# Altium schematic sheet 04-DUT0-1.SchDoc
size 594 x 420 mm
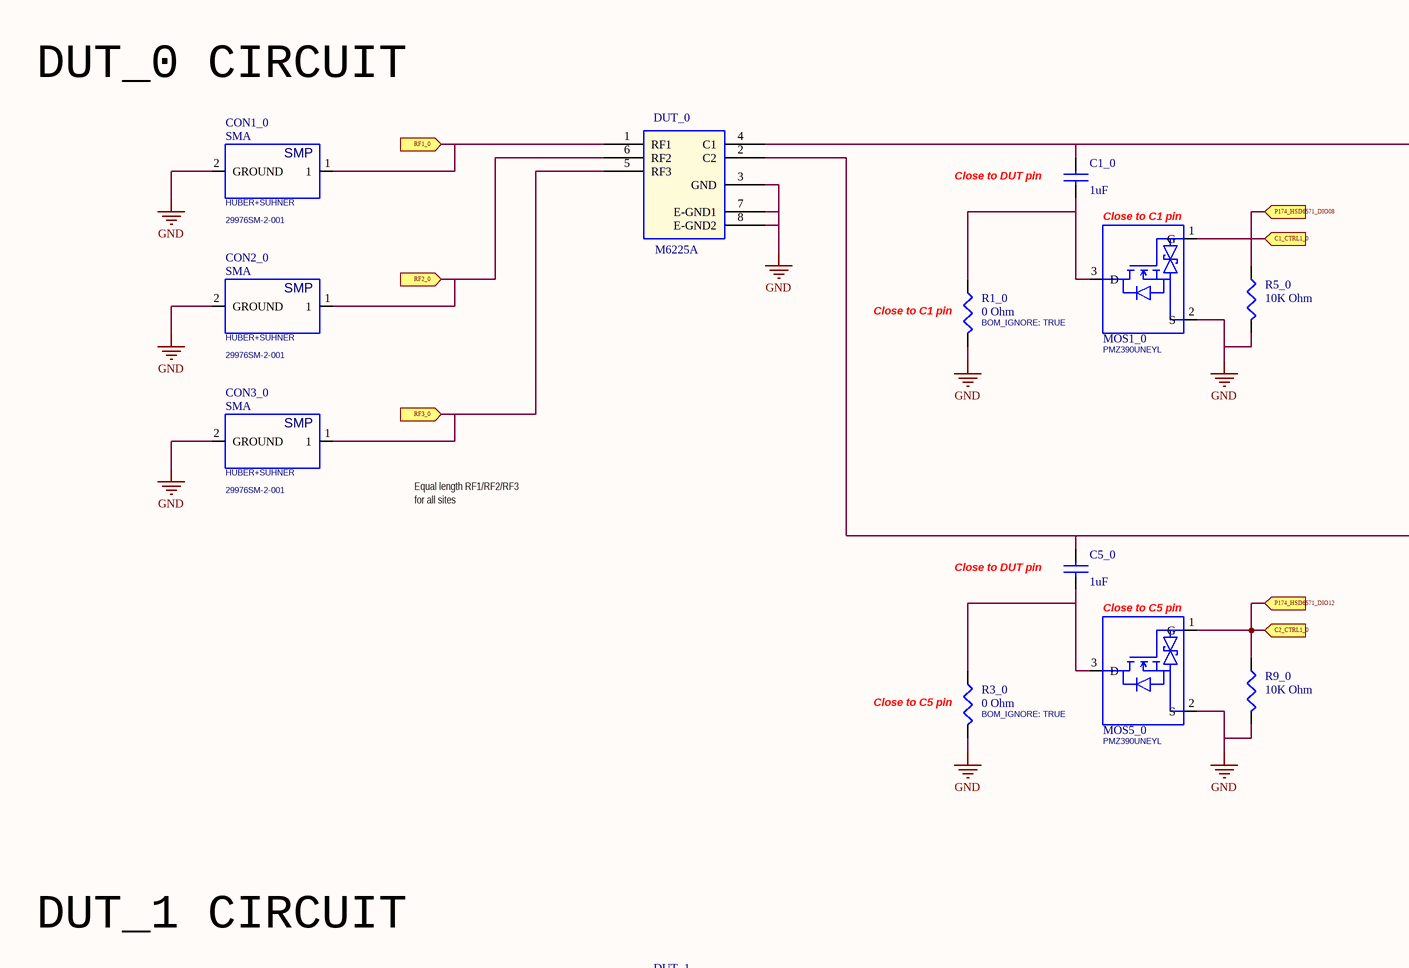
[diagram p0: 04-DUT0-1.SchDoc, top left]
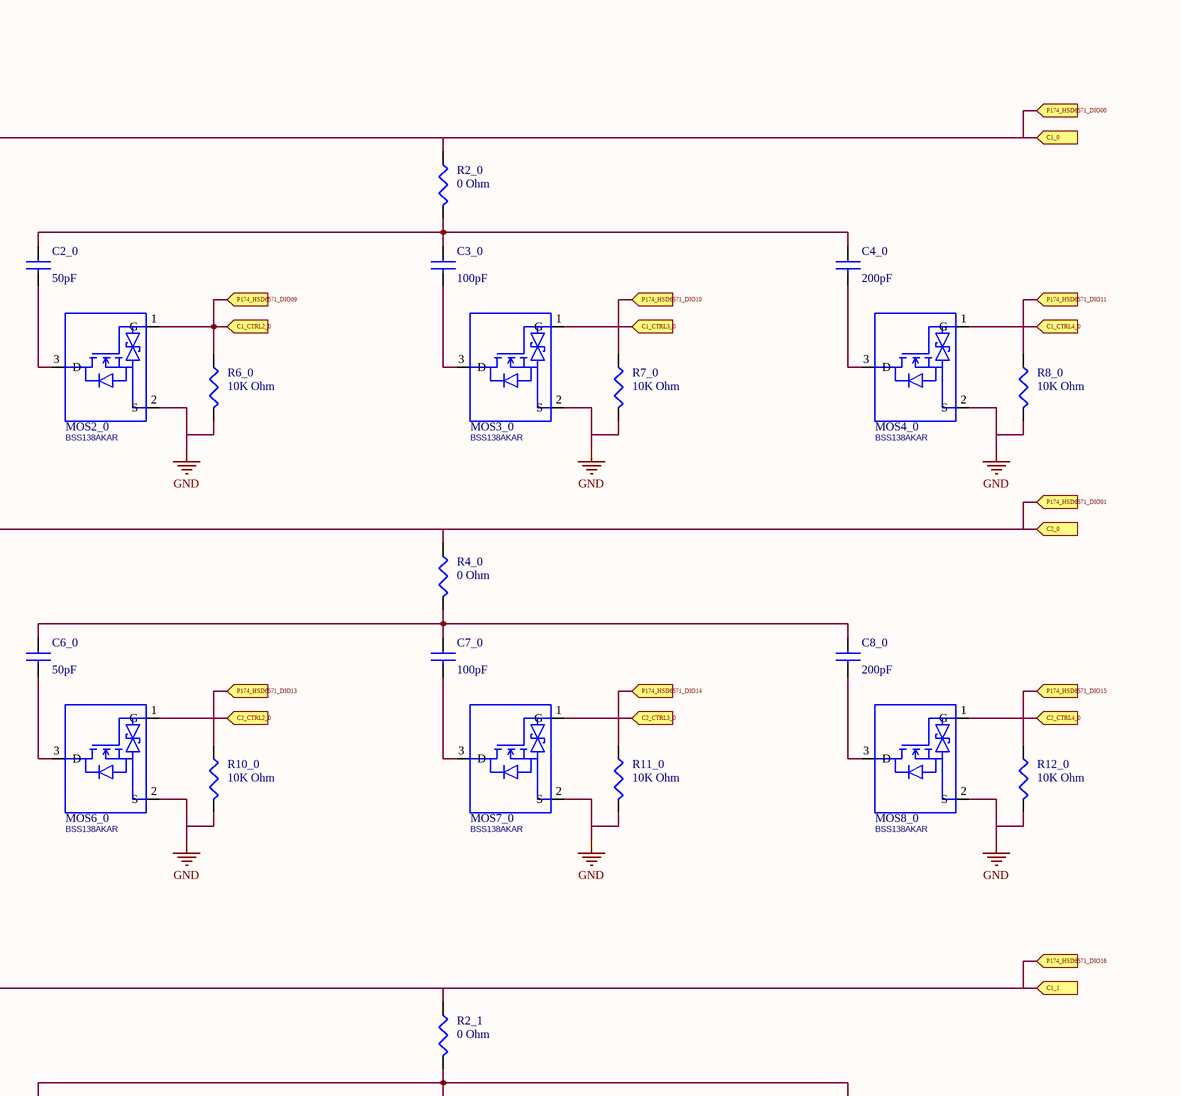
[diagram p1: 04-DUT0-1.SchDoc, top right]
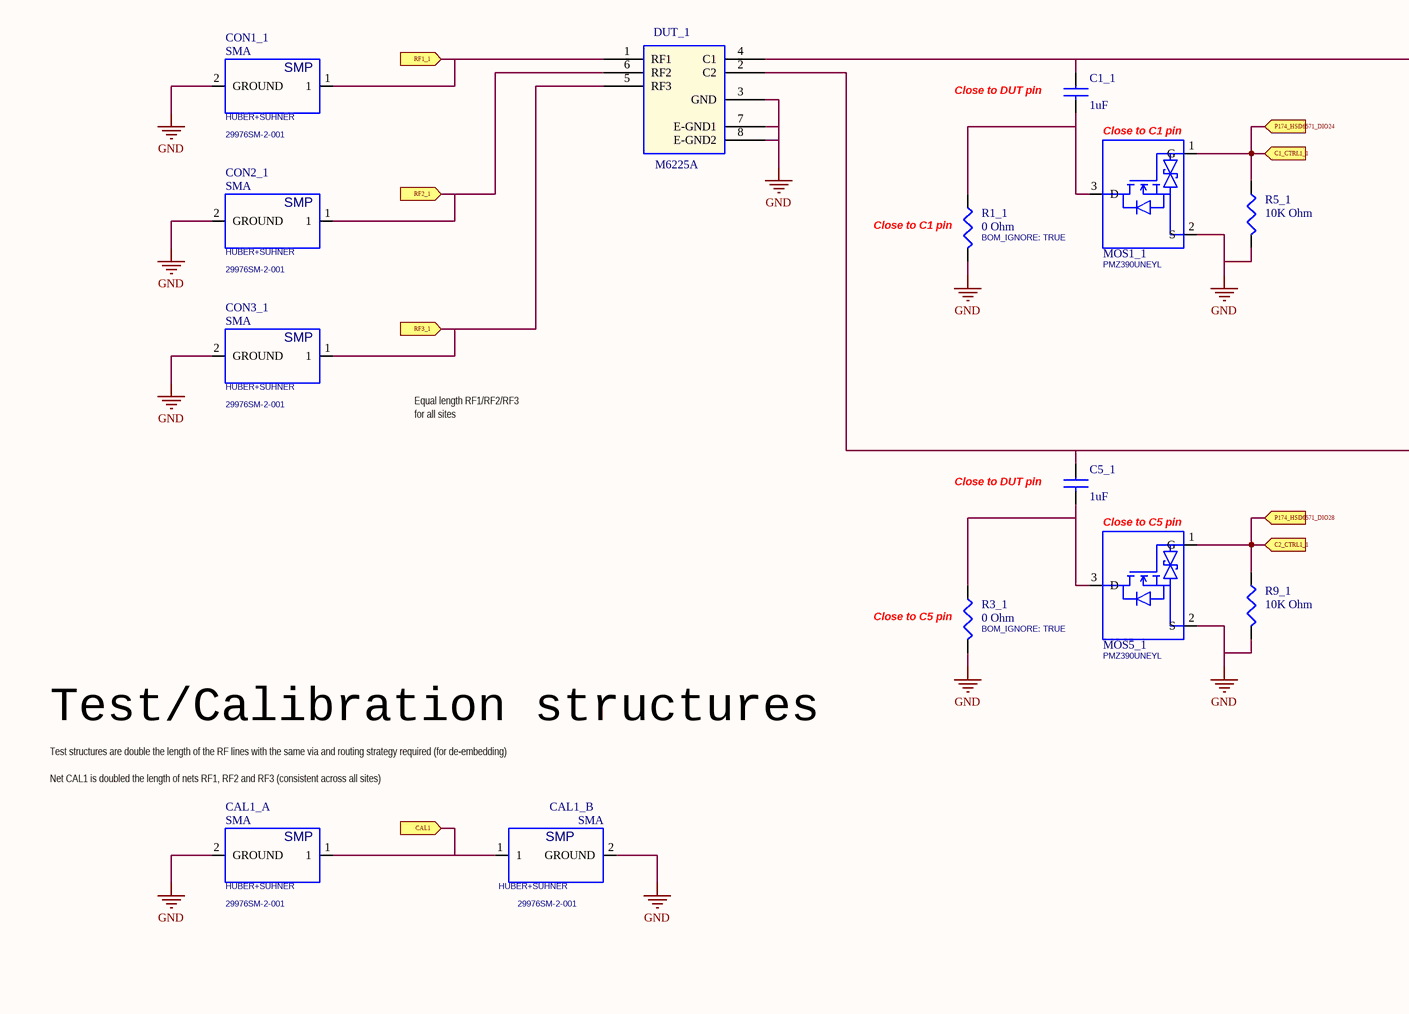
[diagram p2: 04-DUT0-1.SchDoc, bottom left]
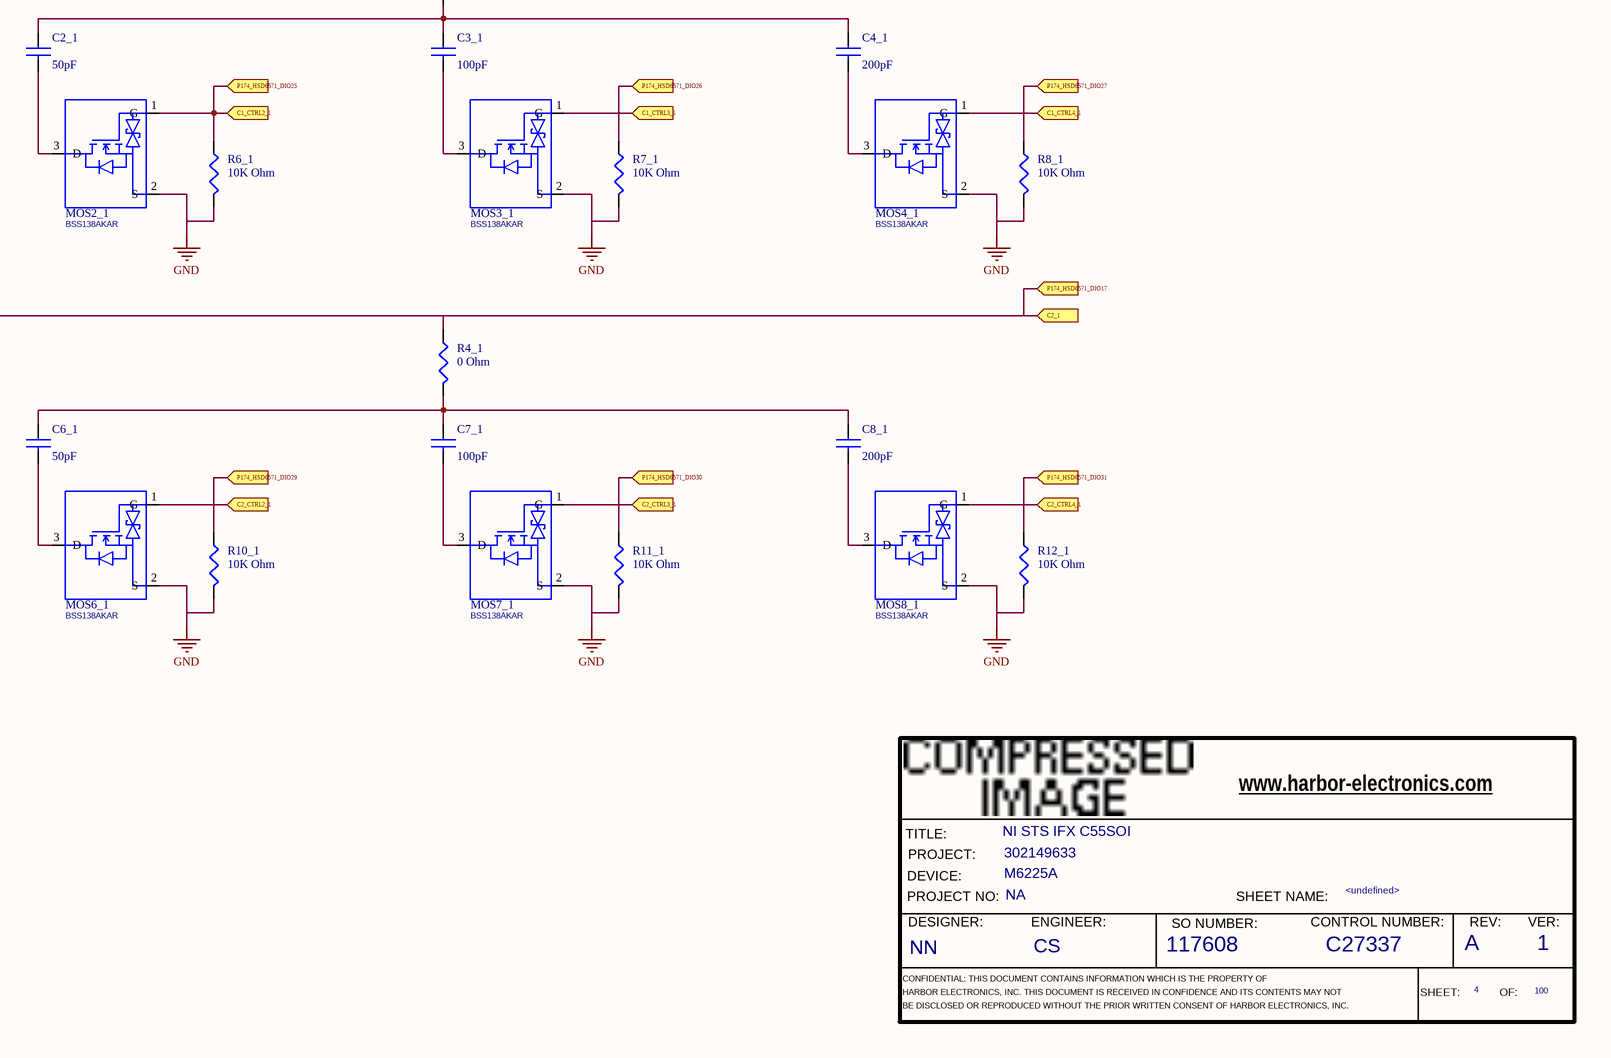
[diagram p3: 04-DUT0-1.SchDoc, bottom right]

## Parts
*  RevCode: A  Title: NI STS IFX C55SOI  Page Number: 4  Page Count: 100  Engineer: CS  Designer: NN  SO Number: 117608  Control Number: C27337  Version: 1  Page Name: <undefined>  PROJECT: 302149633  DEVICE: M6225A  PROJECT NO.: NA  (hidden comment: HE_DEFAULT)  (graphical)
C1_0  1uF  [CAPC1005X65NA]
C1_1  1uF  [CAPC1005X65NA]
C2_0  50pF  [CAPC2012X150NA]
C2_1  50pF  [CAPC2012X150NA]
C3_0  100pF  [CAPC2012X150NA]
C3_1  100pF  [CAPC2012X150NA]
C4_0  200pF  [CAPC2012X150NA]
C4_1  200pF  [CAPC2012X150NA]
C5_0  1uF  [CAPC1005X65NA]
C5_1  1uF  [CAPC1005X65NA]
C6_0  50pF  [CAPC2012X150NA]
C6_1  50pF  [CAPC2012X150NA]
C7_0  100pF  [CAPC2012X150NA]
C7_1  100pF  [CAPC2012X150NA]
C8_0  200pF  [CAPC2012X150NA]
C8_1  200pF  [CAPC2012X150NA]
CAL1_A  SMA  MANUFACTURER: HUBER+SUHNER  PART_NUMBER: 29976SM-2-001  [HUBER_SUHNER_29976SM_2_001NA]
CAL1_B  SMA  MANUFACTURER: HUBER+SUHNER  PART_NUMBER: 29976SM-2-001  [HUBER_SUHNER_29976SM_2_001NA]
CON1_0  SMA  MANUFACTURER: HUBER+SUHNER  PART_NUMBER: 29976SM-2-001  [HUBER_SUHNER_29976SM_2_001NA]
CON1_1  SMA  MANUFACTURER: HUBER+SUHNER  PART_NUMBER: 29976SM-2-001  [HUBER_SUHNER_29976SM_2_001NA]
CON2_0  SMA  PART_NUMBER: 29976SM-2-001  MANUFACTURER: HUBER+SUHNER  [HUBER_SUHNER_29976SM_2_001NA]
CON2_1  SMA  PART_NUMBER: 29976SM-2-001  MANUFACTURER: HUBER+SUHNER  [HUBER_SUHNER_29976SM_2_001NA]
CON3_0  SMA  PART_NUMBER: 29976SM-2-001  MANUFACTURER: HUBER+SUHNER  [HUBER_SUHNER_29976SM_2_001NA]
CON3_1  SMA  PART_NUMBER: 29976SM-2-001  MANUFACTURER: HUBER+SUHNER  [HUBER_SUHNER_29976SM_2_001NA]
DUT_0  M6225A  [dut_302149803]
DUT_1  M6225A  [dut_302149803]
MOS1_0  PART_NUMBER: PMZ390UNEYL  [DFN1006_3NB]  (hidden comment: SINGLE)
MOS1_1  PART_NUMBER: PMZ390UNEYL  [DFN1006_3NB]  (hidden comment: SINGLE)
MOS2_0  SINGLE  [SOT95P240X130_3NA]  (value not drawn)
MOS2_1  SINGLE  [SOT95P240X130_3NA]  (value not drawn)
MOS3_0  SINGLE  [SOT95P240X130_3NA]  (value not drawn)
MOS3_1  SINGLE  [SOT95P240X130_3NA]  (value not drawn)
MOS4_0  SINGLE  [SOT95P240X130_3NA]  (value not drawn)
MOS4_1  SINGLE  [SOT95P240X130_3NA]  (value not drawn)
MOS5_0  PART_NUMBER: PMZ390UNEYL  [DFN1006_3NB]  (hidden comment: SINGLE)
MOS5_1  PART_NUMBER: PMZ390UNEYL  [DFN1006_3NB]  (hidden comment: SINGLE)
MOS6_0  SINGLE  [SOT95P240X130_3NA]  (value not drawn)
MOS6_1  SINGLE  [SOT95P240X130_3NA]  (value not drawn)
MOS7_0  SINGLE  [SOT95P240X130_3NA]  (value not drawn)
MOS7_1  SINGLE  [SOT95P240X130_3NA]  (value not drawn)
MOS8_0  SINGLE  [SOT95P240X130_3NA]  (value not drawn)
MOS8_1  SINGLE  [SOT95P240X130_3NA]  (value not drawn)
R1_0  0 Ohm  BOM_IGNORE: TRUE  [RESC0603X33NB]
R1_1  0 Ohm  BOM_IGNORE: TRUE  [RESC0603X33NB]
R2_0  0 Ohm  [RESC1005X50NA]
R2_1  0 Ohm  [RESC1005X50NA]
R3_0  0 Ohm  BOM_IGNORE: TRUE  [RESC0603X33NB]
R3_1  0 Ohm  BOM_IGNORE: TRUE  [RESC0603X33NB]
R4_0  0 Ohm  [RESC1005X50NA]
R4_1  0 Ohm  [RESC1005X50NA]
R5_0  10K Ohm  [RESC2012X70NA]
R5_1  10K Ohm  [RESC2012X70NA]
R6_0  10K Ohm  [RESC2012X70NA]
R6_1  10K Ohm  [RESC2012X70NA]
R7_0  10K Ohm  [RESC2012X70NA]
R7_1  10K Ohm  [RESC2012X70NA]
R8_0  10K Ohm  [RESC2012X70NA]
R8_1  10K Ohm  [RESC2012X70NA]
R9_0  10K Ohm  [RESC2012X70NA]
R9_1  10K Ohm  [RESC2012X70NA]
R10_0  10K Ohm  [RESC2012X70NA]
R10_1  10K Ohm  [RESC2012X70NA]
R11_0  10K Ohm  [RESC2012X70NA]
R11_1  10K Ohm  [RESC2012X70NA]
R12_0  10K Ohm  [RESC2012X70NA]
R12_1  10K Ohm  [RESC2012X70NA]

## Ports
C1_0 (in), C1_1 (in), C1_CTRL1_0 (in), C1_CTRL1_1 (in), C1_CTRL2_0 (in), C1_CTRL2_1 (in), C1_CTRL3_0 (in), C1_CTRL3_1 (in), C1_CTRL4_0 (in), C1_CTRL4_1 (in), C2_0 (in), C2_1 (in), C2_CTRL1_0 (in), C2_CTRL1_1 (in), C2_CTRL2_0 (in), C2_CTRL2_1 (in), C2_CTRL3_0 (in), C2_CTRL3_1 (in), C2_CTRL4_0 (in), C2_CTRL4_1 (in), CAL1 (in), P174_HSD6571_DIO00 (in), P174_HSD6571_DIO01 (in), P174_HSD6571_DIO08 (in), P174_HSD6571_DIO09 (in), P174_HSD6571_DIO10 (in), P174_HSD6571_DIO11 (in), P174_HSD6571_DIO12 (in), P174_HSD6571_DIO13 (in), P174_HSD6571_DIO14 (in), P174_HSD6571_DIO15 (in), P174_HSD6571_DIO16 (in), P174_HSD6571_DIO17 (in), P174_HSD6571_DIO24 (in), P174_HSD6571_DIO25 (in), P174_HSD6571_DIO26 (in), P174_HSD6571_DIO27 (in), P174_HSD6571_DIO28 (in), P174_HSD6571_DIO29 (in), P174_HSD6571_DIO30 (in), P174_HSD6571_DIO31 (in), RF1_0 (in), RF1_1 (in), RF2_0 (in), RF2_1 (in), RF3_0 (in), RF3_1 (in)

## Nets
GND: CAL1_A.2(GROUND) CAL1_B.2(GROUND) CON1_0.2(GROUND) CON1_1.2(GROUND) CON2_0.2(GROUND) CON2_1.2(GROUND) CON3_0.2(GROUND) CON3_1.2(GROUND) DUT_0.3(GND) DUT_0.7(E-GND1) DUT_0.8(E-GND2) DUT_1.3(GND) DUT_1.7(E-GND1) DUT_1.8(E-GND2) MOS1_0.2(S) MOS1_1.2(S) MOS2_0.2(S) MOS2_1.2(S) MOS3_0.2(S) MOS3_1.2(S) MOS4_0.2(S) MOS4_1.2(S) MOS5_0.2(S) MOS5_1.2(S) MOS6_0.2(S) MOS6_1.2(S) MOS7_0.2(S) MOS7_1.2(S) MOS8_0.2(S) MOS8_1.2(S) R1_0.2 R1_1.2 R3_0.2 R3_1.2 R5_0.2 R5_1.2 R6_0.2 R6_1.2 R7_0.2 R7_1.2 R8_0.2 R8_1.2 R9_0.2 R9_1.2 R10_0.2 R10_1.2 R11_0.2 R11_1.2 R12_0.2 R12_1.2
C1_0: C1_0.1 DUT_0.4(C1) R2_0.1 ; port C1_0, port P174_HSD6571_DIO00
C1_1: C1_1.1 DUT_1.4(C1) R2_1.1 ; port P174_HSD6571_DIO16, port C1_1
C1_CTRL1_0: MOS1_0.1(G) ; port C1_CTRL1_0
C1_CTRL1_1: MOS1_1.1(G) R5_1.1 ; port P174_HSD6571_DIO24, port C1_CTRL1_1
C1_CTRL2_0: MOS2_0.1(G) R6_0.1 ; port P174_HSD6571_DIO09, port C1_CTRL2_0
C1_CTRL2_1: MOS2_1.1(G) R6_1.1 ; port P174_HSD6571_DIO25, port C1_CTRL2_1
C1_CTRL3_0: MOS3_0.1(G) ; port C1_CTRL3_0
C1_CTRL3_1: MOS3_1.1(G) ; port C1_CTRL3_1
C1_CTRL4_0: MOS4_0.1(G) ; port C1_CTRL4_0
C1_CTRL4_1: MOS4_1.1(G) ; port C1_CTRL4_1
C2_0: C5_0.1 DUT_0.2(C2) R4_0.1 ; port P174_HSD6571_DIO01, port C2_0
C2_1: C5_1.1 DUT_1.2(C2) R4_1.1 ; port P174_HSD6571_DIO17, port C2_1
C2_CTRL1_0: MOS5_0.1(G) R9_0.1 ; port P174_HSD6571_DIO12, port C2_CTRL1_0
C2_CTRL1_1: MOS5_1.1(G) R9_1.1 ; port P174_HSD6571_DIO28, port C2_CTRL1_1
C2_CTRL2_0: MOS6_0.1(G) ; port C2_CTRL2_0
C2_CTRL2_1: MOS6_1.1(G) ; port C2_CTRL2_1
C2_CTRL3_0: MOS7_0.1(G) ; port C2_CTRL3_0
C2_CTRL3_1: MOS7_1.1(G) ; port C2_CTRL3_1
C2_CTRL4_0: MOS8_0.1(G) ; port C2_CTRL4_0
C2_CTRL4_1: MOS8_1.1(G) ; port C2_CTRL4_1
CAL1: CAL1_A.1 CAL1_B.1 ; port CAL1
P174_HSD6571_DIO08: R5_0.1 ; port P174_HSD6571_DIO08
P174_HSD6571_DIO10: R7_0.1 ; port P174_HSD6571_DIO10
P174_HSD6571_DIO11: R8_0.1 ; port P174_HSD6571_DIO11
P174_HSD6571_DIO13: R10_0.1 ; port P174_HSD6571_DIO13
P174_HSD6571_DIO14: R11_0.1 ; port P174_HSD6571_DIO14
P174_HSD6571_DIO15: R12_0.1 ; port P174_HSD6571_DIO15
P174_HSD6571_DIO26: R7_1.1 ; port P174_HSD6571_DIO26
P174_HSD6571_DIO27: R8_1.1 ; port P174_HSD6571_DIO27
P174_HSD6571_DIO29: R10_1.1 ; port P174_HSD6571_DIO29
P174_HSD6571_DIO30: R11_1.1 ; port P174_HSD6571_DIO30
P174_HSD6571_DIO31: R12_1.1 ; port P174_HSD6571_DIO31
RF1_0: CON1_0.1 DUT_0.1(RF1) ; port RF1_0
RF1_1: CON1_1.1 DUT_1.1(RF1) ; port RF1_1
RF2_0: CON2_0.1 DUT_0.6(RF2) ; port RF2_0
RF2_1: CON2_1.1 DUT_1.6(RF2) ; port RF2_1
RF3_0: CON3_0.1 DUT_0.5(RF3) ; port RF3_0
RF3_1: CON3_1.1 DUT_1.5(RF3) ; port RF3_1
NetC1_0_2: C1_0.2 MOS1_0.3(D) R1_0.1
NetC1_1_2: C1_1.2 MOS1_1.3(D) R1_1.1
NetC2_0_1: C2_0.1 C3_0.1 C4_0.1 R2_0.2
NetC2_0_2: C2_0.2 MOS2_0.3(D)
NetC2_1_1: C2_1.1 C3_1.1 C4_1.1 R2_1.2
NetC2_1_2: C2_1.2 MOS2_1.3(D)
NetC3_0_2: C3_0.2 MOS3_0.3(D)
NetC3_1_2: C3_1.2 MOS3_1.3(D)
NetC4_0_2: C4_0.2 MOS4_0.3(D)
NetC4_1_2: C4_1.2 MOS4_1.3(D)
NetC5_0_2: C5_0.2 MOS5_0.3(D) R3_0.1
NetC5_1_2: C5_1.2 MOS5_1.3(D) R3_1.1
NetC6_0_1: C6_0.1 C7_0.1 C8_0.1 R4_0.2
NetC6_0_2: C6_0.2 MOS6_0.3(D)
NetC6_1_1: C6_1.1 C7_1.1 C8_1.1 R4_1.2
NetC6_1_2: C6_1.2 MOS6_1.3(D)
NetC7_0_2: C7_0.2 MOS7_0.3(D)
NetC7_1_2: C7_1.2 MOS7_1.3(D)
NetC8_0_2: C8_0.2 MOS8_0.3(D)
NetC8_1_2: C8_1.2 MOS8_1.3(D)

## Notes on the sheet
- DUT_0 CIRCUIT
- (near C1_0) Close to DUT pin
- (near MOS1_0) Close to C1 pin
- (near R1_0) Close to C1 pin
- Equal length RF1/RF2/RF3
- for all sites
- (near C5_0) Close to DUT pin
- (near MOS5_0) Close to C5 pin
- (near R3_0) Close to C5 pin
- DUT_1 CIRCUIT
- (near C1_1) Close to DUT pin
- (near MOS1_1) Close to C1 pin
- (near R1_1) Close to C1 pin
- (near C5_1) Close to DUT pin
- (near MOS5_1) Close to C5 pin
- (near R3_1) Close to C5 pin
- Test/Calibration structures
- Test structures are double the length of the RF lines with the same via and routing strategy required (for de-embedding)
- Net CAL1 is doubled the length of nets RF1, RF2 and RF3 (consistent across all sites)
- (in symbol 29976sm_2_001) SMP
- (in symbol HE_DEFAULT) www.harbor-electronics.com; TITLE:; PROJECT:; DEVICE:; PROJECT NO:; SHEET NAME:; DESIGNER:; ENGINEER:; SO NUMBER:; CONTROL NUMBER:; REV:; VER:; CONFIDENTIAL: THIS DOCUMENT CONTAINS INFORMATION WHICH IS THE PROPERTY OF; HARBOR ELECTRONICS, INC. THIS DOCUMENT IS RECEIVED IN CONFIDENCE AND ITS CONTENTS MAY NOT; SHEET:; OF:; BE DISCLOSED OR REPRODUCED WITHOUT THE PRIOR WRITTEN CONSENT OF HARBOR ELECTRONICS, INC.

## Library data of the parts
* = HE_DEFAULT: Page Size: X; OrgAddr4: Fax: +1 602-431-9633; OrgAddr1: 4050 E. Cotton Center Blvd., Suite 33; OrgAddr2: Phoenix, Arizona 85040 U.S.A.; OrgAddr3: Phone: +1 602-438-1112; Doc: <Title Name>; OrgName: HARBOR
C1_0 C5_0 = capacitor: ALT_SYMBOLS: (CAPC1005X65N,CAPC1005X65N_NT,CAPC1005X65L,CAPC1005X65NA_HS); CLASS: DISCRETE; LIB_NAME: Capacitor; HEIGHT: 0.5 mm; PCB Footprint: CAPC1005X65NA
C1_1 C5_1 = capacitor: CLASS: DISCRETE; ALT_SYMBOLS: (CAPC1005X65N,CAPC1005X65N_NT,CAPC1005X65L,CAPC1005X65NA_HS); HEIGHT: 0.5 mm; LIB_NAME: Capacitor; PCB Footprint: CAPC1005X65NA
C2_0 C6_0 = capacitor: Cap Ceramic 50pF 100V C0G 1% Pad SMD 0805 125degC; PART_NUMBER: 08051A500FAT2A; MANUFACTURER: KYOCERA AVX Components Corporation; CLASS: DISCRETE; ALT_SYMBOLS: (CAPC2012X150N,CAPC2012X150L); LIB_NAME: z_Capacitor_Individual; HEIGHT: 0.94 mm; PCB Footprint: CAPC2012X150NA
C2_1 C6_1 = capacitor: Cap Ceramic 50pF 100V C0G 1% Pad SMD 0805 125degC; MANUFACTURER: KYOCERA AVX Components Corporation; PART_NUMBER: 08051A500FAT2A; LIB_NAME: z_Capacitor_Individual; ALT_SYMBOLS: (CAPC2012X150N,CAPC2012X150L); CLASS: DISCRETE; HEIGHT: 0.94 mm; PCB Footprint: CAPC2012X150NA
C3_0 C7_0 = capacitor: CLASS: DISCRETE; ALT_SYMBOLS: (CAPC2012X150N,CAPC2012X150L); HEIGHT: 0.94(Max) mm; LIB_NAME: Capacitor; PCB Footprint: CAPC2012X150NA
C3_1 C7_1 = capacitor: ALT_SYMBOLS: (CAPC2012X150N,CAPC2012X150L); CLASS: DISCRETE; LIB_NAME: Capacitor; HEIGHT: 0.94(Max) mm; PCB Footprint: CAPC2012X150NA
C4_0 C8_1 = capacitor: Cap Ceramic 200pF 50V C0G 1% Pad SMD 0805 125degC; PART_NUMBER: 08055A201FAT2A; MANUFACTURER: KYOCERA AVX Components Corporation; CLASS: DISCRETE; ALT_SYMBOLS: (CAPC2012X150N,CAPC2012X150L); LIB_NAME: z_Capacitor_Individual; HEIGHT: 0.94 mm; PCB Footprint: CAPC2012X150NA
C4_1 C8_0 = capacitor: Cap Ceramic 200pF 50V C0G 1% Pad SMD 0805 125degC; MANUFACTURER: KYOCERA AVX Components Corporation; PART_NUMBER: 08055A201FAT2A; LIB_NAME: z_Capacitor_Individual; ALT_SYMBOLS: (CAPC2012X150N,CAPC2012X150L); CLASS: DISCRETE; HEIGHT: 0.94 mm; PCB Footprint: CAPC2012X150NA
CAL1_A CAL1_B CON1_0 CON1_1 = 29976sm_2_001: RF Coaxial Connectors; LIB_NAME: z_Connector_Individual; ALT_SYMBOLS: (HUBER_SUHNER_29976SM_2_001N,HUBER_SUHNER_29976SM_2_001_OPT1); CLASS: IC; PCB Footprint: HUBER_SUHNER_29976SM_2_001NA; HEIGHT: 5.237 MM
CON2_0 CON2_1 CON3_0 CON3_1 = 29976sm_2_001: RF Coaxial Connectors; CLASS: IC; ALT_SYMBOLS: (HUBER_SUHNER_29976SM_2_001N,HUBER_SUHNER_29976SM_2_001_OPT1); LIB_NAME: z_Connector_Individual; PCB Footprint: HUBER_SUHNER_29976SM_2_001NA; HEIGHT: 5.237 MM
MOS1_0 MOS5_1 = pmz390une: Trans MOSFET N-CH 30V 0.9A 3-Pin DFN; MANUFACTURER: Nexperia; CLASS: IC; ALT_SYMBOLS: (DFN1006_3N); LIB_NAME: z_Transistor_Individual; HEIGHT: 0.50 MM; PCB Footprint: DFN1006_3NB
MOS1_1 MOS5_0 = pmz390une: Trans MOSFET N-CH 30V 0.9A 3-Pin DFN; MANUFACTURER: Nexperia; LIB_NAME: z_Transistor_Individual; ALT_SYMBOLS: (DFN1006_3N); CLASS: IC; HEIGHT: 0.50 MM; PCB Footprint: DFN1006_3NB
MOS2_0 MOS3_1 MOS4_1 MOS6_0 MOS7_1 MOS8_1 = bss138akar: Trans MOSFET N-CH 60V 0.2A Automotive AEC-Q101 3-Pin SOT-23; MANUFACTURER: Nexperia; LIB_NAME: z_Transistor_Individual; ALT_SYMBOLS: (SOT95P240X130_3N); CLASS: IC; PART_NUMBER: BSS138AKAR; HEIGHT: 1.10 MM; PCB Footprint: SOT95P240X130_3NA
MOS2_1 MOS3_0 MOS4_0 MOS6_1 MOS7_0 MOS8_0 = bss138akar: Trans MOSFET N-CH 60V 0.2A Automotive AEC-Q101 3-Pin SOT-23; MANUFACTURER: Nexperia; CLASS: IC; ALT_SYMBOLS: (SOT95P240X130_3N); LIB_NAME: z_Transistor_Individual; HEIGHT: 1.10 MM; PART_NUMBER: BSS138AKAR; PCB Footprint: SOT95P240X130_3NA
R1_0 R1_1 R3_0 R3_1 = resistor: CLASS: DISCRETE; ALT_SYMBOLS: (RESC0603X33N,RESC0603X33L); AML_PN: 775-1493-00; PCB Footprint: RESC0603X33NB; HEIGHT: 0.23 mm; LIB_NAME: Resistor
R2_0 R4_1 = resistor: CLASS: DISCRETE; ALT_SYMBOLS: (RESC1005X60N_NTA;RESC1005X50N;RESC1005X50NA_HS;RESC1005X60L); AML_PN: 775-0014-00; HEIGHT: 0.35 mm; LIB_NAME: Resistor; PCB Footprint: RESC1005X50NA
R2_1 R4_0 = resistor: AML_PN: 775-0014-00; ALT_SYMBOLS: (RESC1005X60N_NTA;RESC1005X50N;RESC1005X50NA_HS;RESC1005X60L); CLASS: DISCRETE; LIB_NAME: Resistor; HEIGHT: 0.35 mm; PCB Footprint: RESC1005X50NA
R5_0 R6_0 R7_0 R8_0 R9_0 R10_0 R11_0 R12_0 = resistor: Res Thick Film 0805 10K Ohm 0.5% 0.5W(1/2W) +/-100ppm/degC Pad SMD  Automotive AEC-Q200; MANUFACTURER: Panasonic; PART_NUMBER: ERJHP6D1002V; LIB_NAME: z_Resistor_Individual; AML_PN: 775-2282-00-01; ALT_SYMBOLS: (RESC2012X70N,RESC2012X84L); CLASS: DISCRETE; HEIGHT: 0.70 mm; PCB Footprint: RESC2012X70NA
R5_1 R6_1 R7_1 R8_1 R9_1 R10_1 R11_1 R12_1 = resistor: Res Thick Film 0805 10K Ohm 0.5% 0.5W(1/2W) +/-100ppm/degC Pad SMD  Automotive AEC-Q200; PART_NUMBER: ERJHP6D1002V; MANUFACTURER: Panasonic; CLASS: DISCRETE; ALT_SYMBOLS: (RESC2012X70N,RESC2012X84L); AML_PN: 775-2282-00-01; LIB_NAME: z_Resistor_Individual; HEIGHT: 0.70 mm; PCB Footprint: RESC2012X70NA
DUT_0 DUT_1 = M6225A: PCB Footprint: dut_302149803